# EAGLE design RFID_R1 (EAGLE 9.4.2)

## Sheet 1 of 2

## Sheet 2 of 2
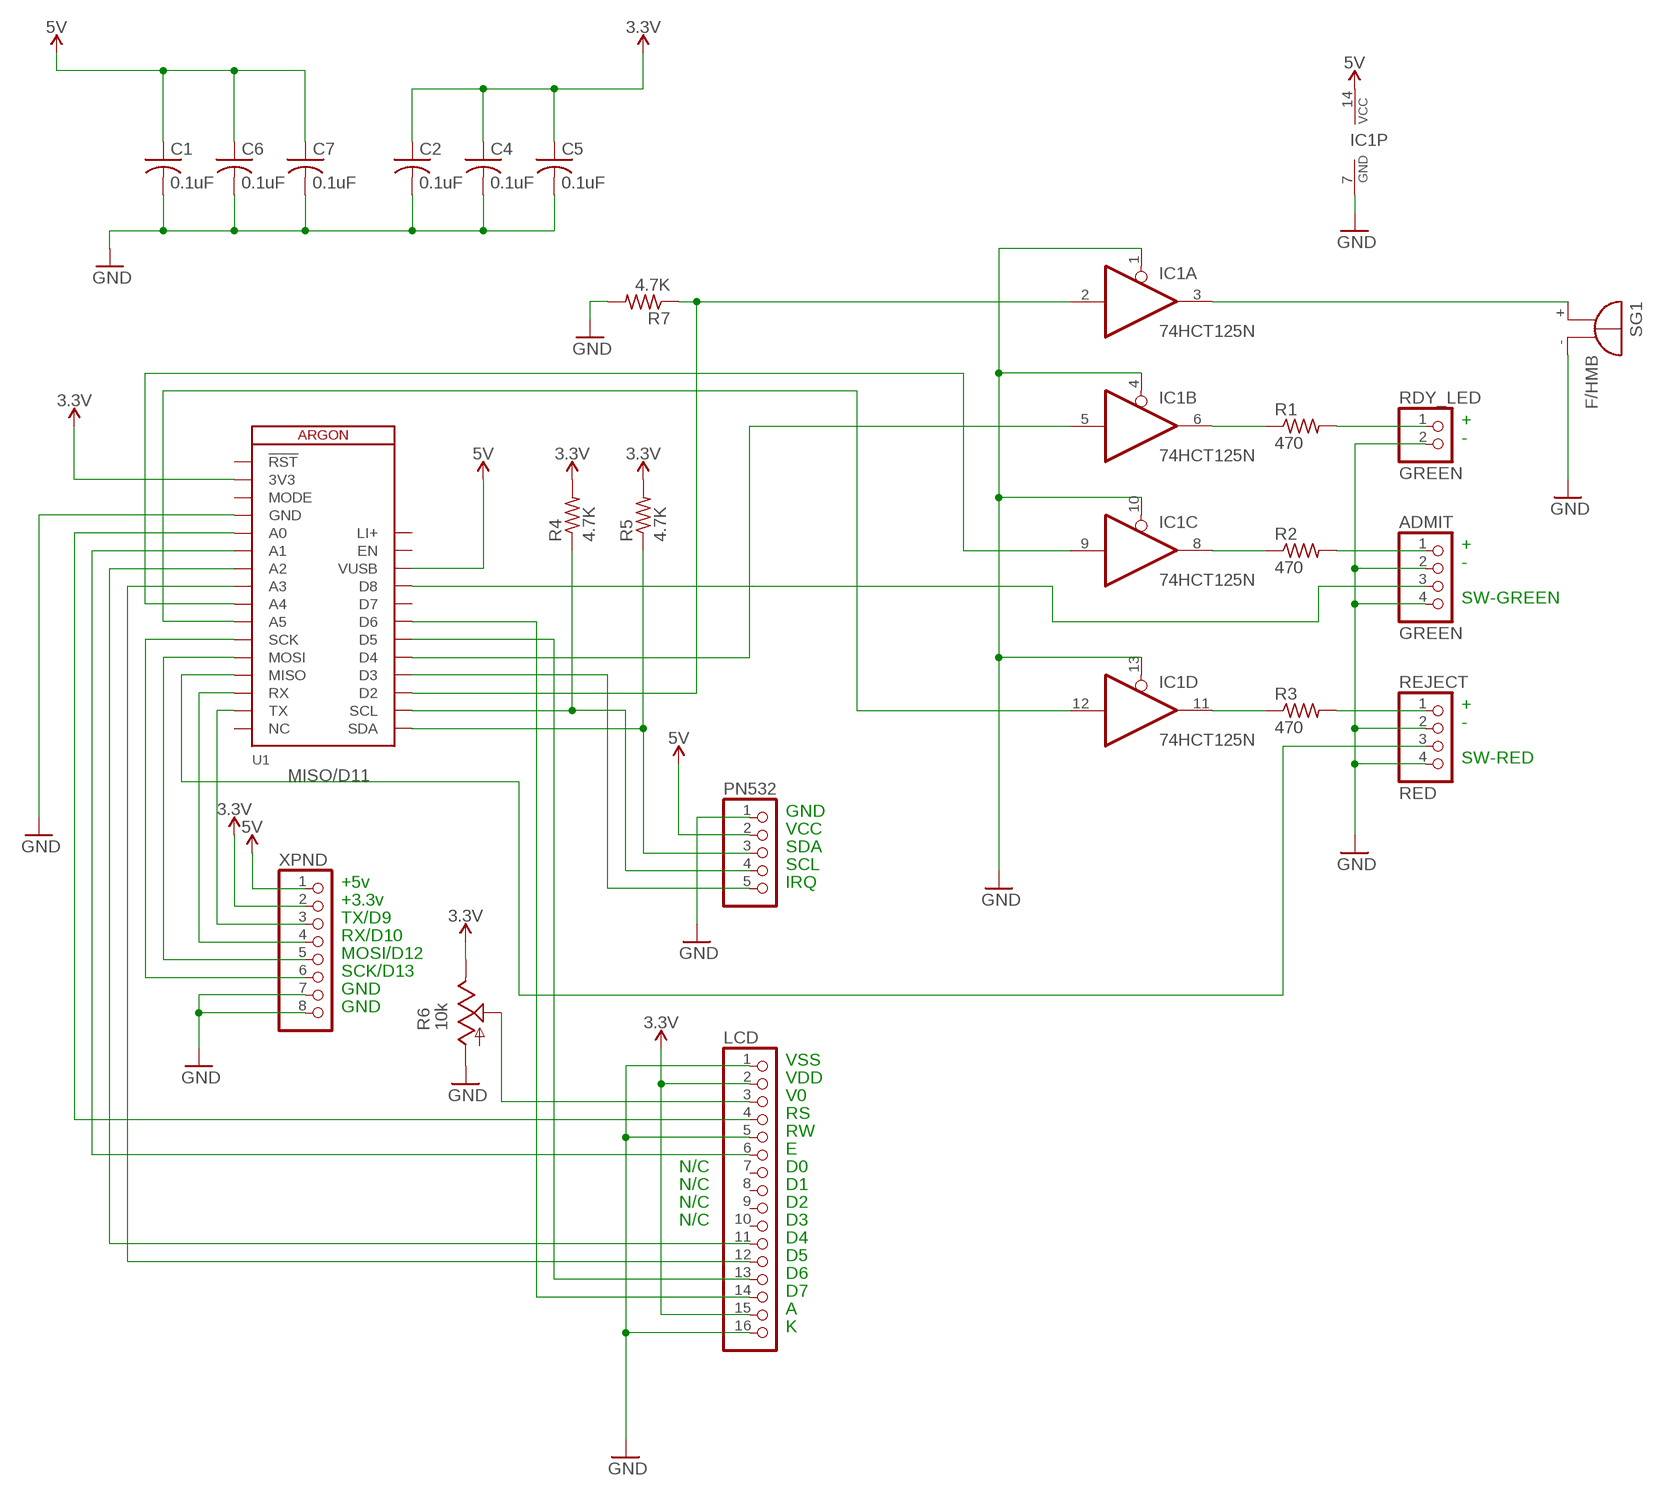
[diagram p0: schematic, sheet 2]

### Parts
ADMIT  GREEN  PINHD-1X4  [1X04]
C1  0.1uF  C-US025-024X044  [C025-024X044]
C2  0.1uF  C-US025-024X044  [C025-024X044]
C4  0.1uF  C-US025-024X044  [C025-024X044]
C5  0.1uF  C-US025-024X044  [C025-024X044]
C6  0.1uF  C-US025-024X044  [C025-024X044]
C7  0.1uF  C-US025-024X044  [C025-024X044]
IC1  74HCT125N  [DIL14]
LCD  PINHD-1X16  [1X16]
PN532  PINHD-1X5  [1X05]
R1  470  R-US_0204/7  [0204/7]
R2  470  R-US_0204/7  [0204/7]
R3  470  R-US_0204/7  [0204/7]
R4  4.7K  R-US_0204/7  [0204/7]
R5  4.7K  R-US_0204/7  [0204/7]
R6  10k  TRIM_US-CT6  [CT6]
R7  4.7K  R-US_0204/7  [0204/7]
RDY_LED  GREEN  PINHD-1X2  [1X02]
REJECT  RED  PINHD-1X4  [1X04]
SG1  F/HMB  [F/HMB]
U1  ARGON  [ARGON]
XPND  PINHD-1X8BIG  [1X08-BIG]

### Nets
3.3V: C2.1 C4.1 C5.1 LCD.2 LCD.15 R4.2 R5.2 R6.E U1.2(3V3) XPND.2
5V: C1.1 C6.1 C7.1 IC1.14(P:VCC) PN532.2 U1.26(VUSB) XPND.1
GND: ADMIT.2 ADMIT.4 C1.2 C2.2 C4.2 C5.2 C6.2 C7.2 IC1.1(A:OE) IC1.4(B:OE) IC1.7(P:GND) IC1.10(C:OE) IC1.13(D:OE) LCD.1 LCD.5 LCD.16 PN532.1 R6.A R7.2 RDY_LED.2 REJECT.2 REJECT.4 SG1.- U1.4(GND) XPND.7 XPND.8
MISO/D11: REJECT.3 U1.13(MISO)
N$1: IC1.3(A:O) SG1.+
N$2: IC1.6(B:O) R1.1
N$3: IC1.8(C:O) R2.1
N$4: IC1.11(D:O) R3.1
N$5: R1.2 RDY_LED.1
N$6: ADMIT.1 R2.2
N$7: R3.2 REJECT.1
N$8: LCD.4 U1.5(A0)
N$9: LCD.6 U1.6(A1)
N$10: LCD.11 U1.7(A2)
N$11: LCD.12 U1.8(A3)
N$12: LCD.13 U1.22(D5)
N$13: LCD.14 U1.23(D6)
N$14: PN532.4 R4.1 U1.18(SCL)
N$15: IC1.9(C:I) U1.9(A4)
N$16: PN532.3 R5.1 U1.17(SDA)
N$17: LCD.3 R6.S
N$18: PN532.5 U1.20(D3)
N$19: ADMIT.3 U1.25(D8)
N$20: IC1.5(B:I) U1.21(D4)
N$21: IC1.12(D:I) U1.10(A5)
N$22: IC1.2(A:I) R7.1 U1.19(D2)
N$24: U1.12(MOSI) XPND.5
N$25: U1.11(SCK) XPND.6
N$26: U1.14(RX) XPND.4
N$27: U1.15(TX) XPND.3
Unconnected: LCD.7 LCD.8 LCD.9 LCD.10 U1.1(!RST) U1.3(MODE) U1.16(NC) U1.24(D7) U1.27(EN)

### Notes on the sheet
- +
- -
- +
- -
- SW-GREEN
- +
- -
- SW-RED
- GND
- VCC
- SDA
- SCL
- +5v | IRQ
- +3.3v
- TX/D9
- RX/D10
- MOSI/D12
- SCK/D13
- GND
- GND
- VSS
- VDD
- V0
- RS
- RW
- E
- N/C | D0
- N/C | D1
- N/C | D2
- N/C | D3
- D4
- D5
- D6
- D7
- A
- K

## Power pins joined to a net without a drawn wire
LI+: U1.28(LI+)

## Library data of the parts
ADMIT REJECT = pinhead:PINHD-1X4: PIN HEADER
C1 C2 C4-C7 = adafruit:C-US: CAPACITOR, American symbol
IC1 = 74xx-eu:74*125: Quad bus BUFFER, 3-state
LCD = pinhead:PINHD-1X16: PIN HEADER
PN532 = pinhead:PINHD-1X5: PIN HEADER
R1-R5 R7 = adafruit:R-US_: RESISTOR, American symbol
R6 = pot:TRIM_US-: POTENTIOMETER
RDY_LED = pinhead:PINHD-1X2: PIN HEADER
SG1 = buzzer:F/HMB: BUZZER Source: Buerklin; OC_FARNELL: unknown; OC_NEWARK: unknown
U1 = Particle-Devices:ARGON: ARGON The Particle Argon is a powerful Wi-Fi development kit that you can use as a standalone Wi-Fi device or Wi-Fi enabled gateway, repeater, or endpoint for Particle Mesh networks. More information: https://docs.particle.io/argon/ Footprint and formfactor based on Adafruit Feather. <https://www.adafruit.com/feather>
XPND = adafruit:PINHD-1X8: PIN HEADER

## Board
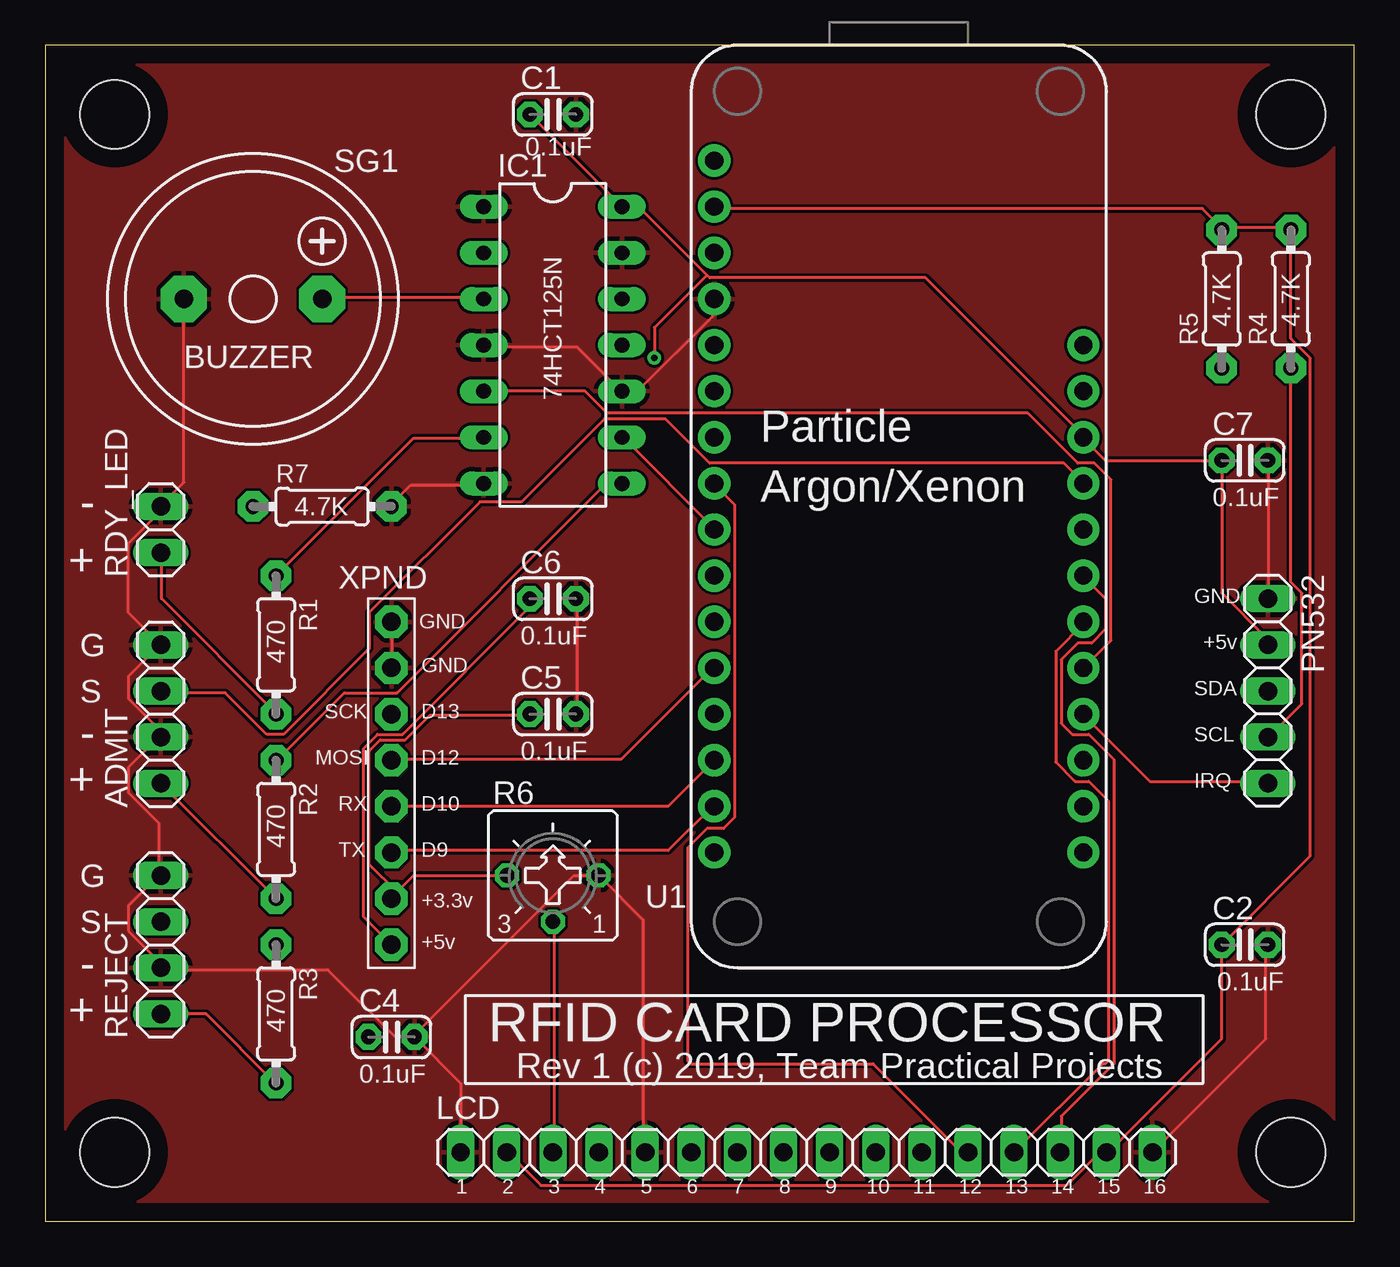
[diagram p1: board, top side]
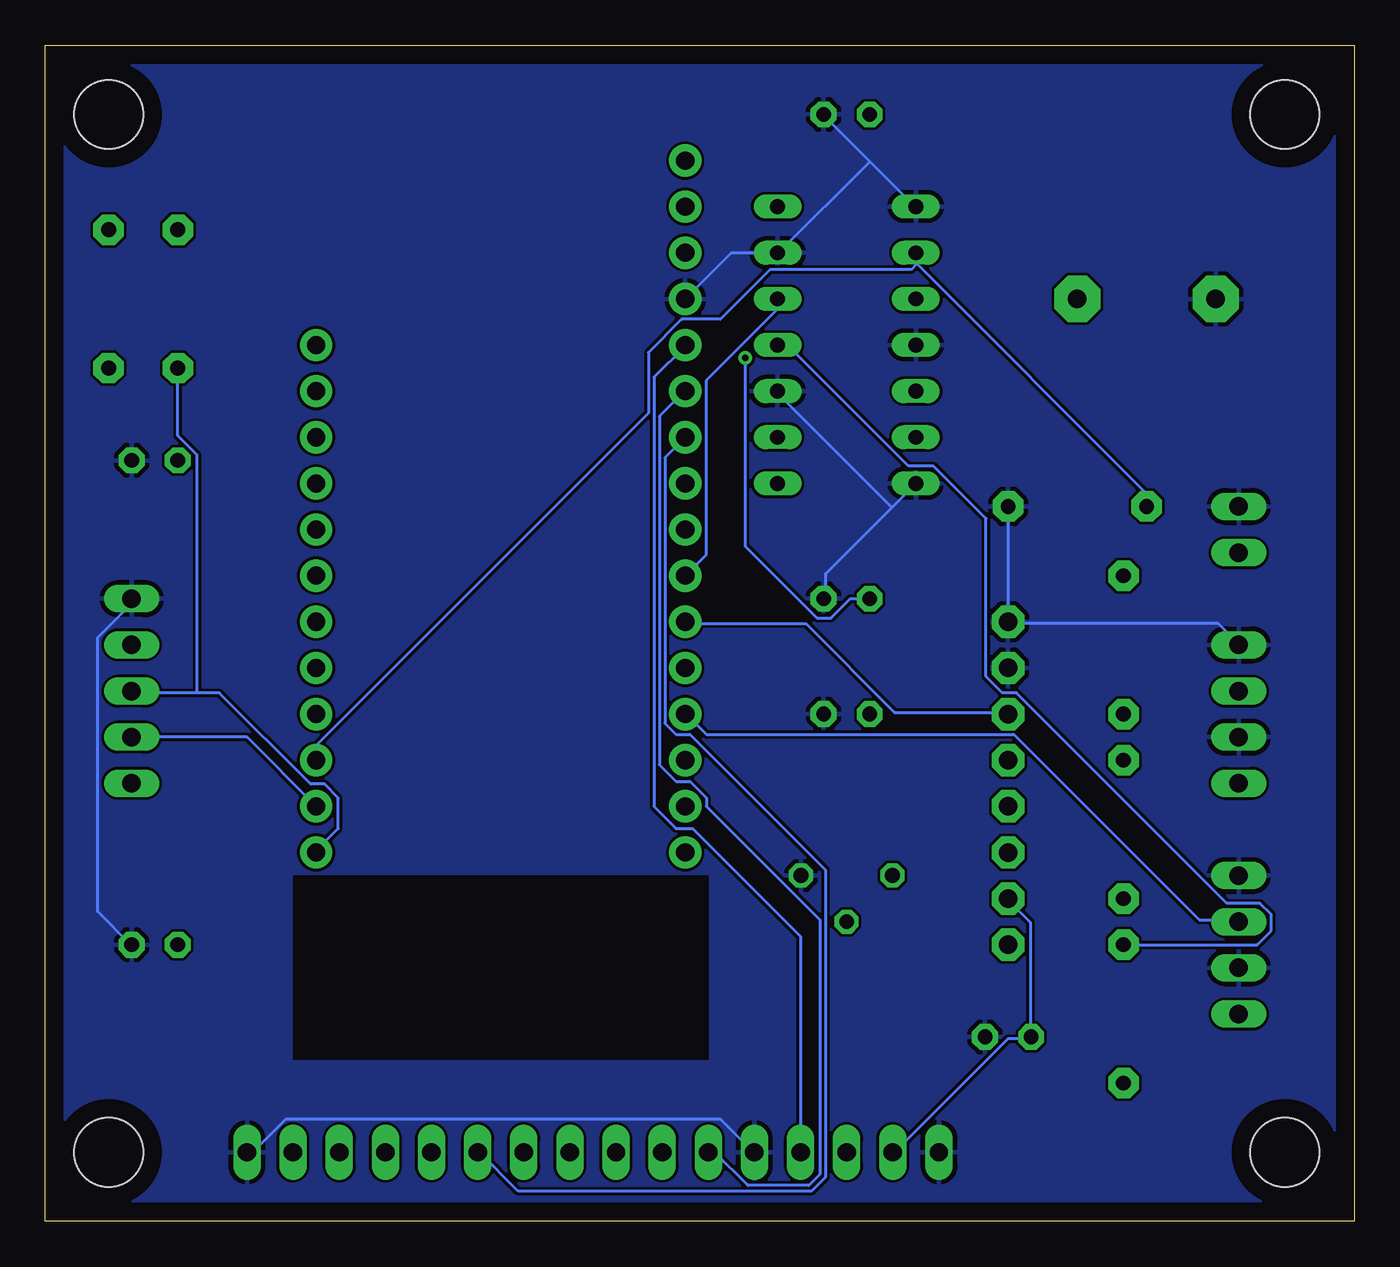
[diagram p2: board, bottom side, seen from below]

Size 72.06 x 64.76 mm. Coordinates in mm from the lower left corner, seen from the top.
Outline: 0,0 72.06,0 72.06,64.76 0,64.76 0,0
Copper layers (1*16): Top 0.035mm / dielectric 1.5mm / Bottom 0.035mm
Design rules "default": minimum track width 6mil, minimum drill 0.35mm, track to track 6mil, track to pad 6mil, pad to pad 6mil, via to via 6mil, smd to smd 6mil, copper to edge 40mil, drill to drill 6mil, minimum pad ring 10mil, minimum via ring 8mil, stop-mask expansion 4mil, vias tented up to drill 0mil, thermal gap 10mil
Holes 3.8 mm at 68.58,60.96 68.58,3.81 3.81,60.96 3.81,3.81

### Footprints (pad centres in the part's own frame; a part is rotated, then mirrored left to right if it is on the bottom)
1X04 = drill 1.016 long: 1 -3.81,0; 2 -1.27,0; 3 1.27,0; 4 3.81,0
C025-024X044 = drill 0.813 pad 1.422 octagon: 1 -1.27,0; 2 1.27,0
DIL14 = drill 0.813 long: 1 -7.62,-3.81; 2 -5.08,-3.81; 3 -2.54,-3.81; 4 0,-3.81; 5 2.54,-3.81; 6 5.08,-3.81; 7 7.62,-3.81; 8 7.62,3.81; 9 5.08,3.81; 10 2.54,3.81; 11 0,3.81; 12 -2.54,3.81; 13 -5.08,3.81; 14 -7.62,3.81
1X16 = drill 1.016 long: 1 -19.05,0; 2 -16.51,0; 3 -13.97,0; 4 -11.43,0; 5 -8.89,0; 6 -6.35,0; 7 -3.81,0; 8 -1.27,0; 9 1.27,0; 10 3.81,0; 11 6.35,0; 12 8.89,0; 13 11.43,0; 14 13.97,0; 15 16.51,0; 16 19.05,0
1X05 = drill 1.016 long: 1 -5.08,0; 2 -2.54,0; 3 0,0; 4 2.54,0; 5 5.08,0
0204/7 = drill 0.813 pad 1.676 octagon: 1 -3.81,0; 2 3.81,0
CT6 = drill 0.813 octagon: A 2.515,0; E -2.515,0; S 0,-2.54
1X02 = drill 1.016 long: 1 -1.27,0; 2 1.27,0
F/HMB = drill 1.016 pad 2.54 octagon: + 3.81,0; - -3.81,0
ARGON = drill 1 pad 1.778: 1 1.27,44.45; 2 1.27,41.91; 3 1.27,39.37; 4 1.27,36.83; 5 1.27,34.29; 6 1.27,31.75; 7 1.27,29.21; 8 1.27,26.67; 9 1.27,24.13; 10 1.27,21.59; 11 1.27,19.05; 12 1.27,16.51; 13 1.27,13.97; 14 1.27,11.43; 15 1.27,8.89; 16 1.27,6.35; 17 21.59,6.35; 18 21.59,8.89; 19 21.59,11.43; 20 21.59,13.97; 21 21.59,16.51; 22 21.59,19.05; 23 21.59,21.59; 24 21.59,24.13; 25 21.59,26.67; 26 21.59,29.21; 27 21.59,31.75; 28 21.59,34.29
1X08-BIG = drill 1.016 pad 1.778 octagon: 1 -8.89,0; 2 -6.35,0; 3 -3.81,0; 4 -1.27,0; 5 1.27,0; 6 3.81,0; 7 6.35,0; 8 8.89,0

### Placement (x,y rotation side)
ADMIT  6.35,27.94 90 top
C1  27.94,60.96 0 top
C2  66.04,15.24 0 top
C4  19.05,10.16 0 top
C5  27.94,27.94 0 top
C6  27.94,34.29 0 top
C7  66.04,41.91 0 top
IC1  27.94,48.26 270 top
LCD  41.91,3.81 0 top
PN532  67.31,29.21 270 top
R1  12.7,31.75 270 top
R2  12.7,21.59 270 top
R3  12.7,11.43 270 top
R4  68.58,50.8 90 top
R5  64.77,50.8 90 top
R6  27.94,19.05 0 top
R7  15.24,39.37 0 top
RDY_LED  6.35,38.1 90 top
REJECT  6.35,15.24 90 top
SG1  11.43,50.8 0 top
U1  35.56,13.97 0 top
XPND  19.05,24.13 90 top

### Tracks (layer width: path | path; a pad name or v marks a point on that pad's centre or on a via)
3.3V
  Top 0.152: 64.77,54.71 68.58,54.71 R4.2 68.58,48.62 69.65,47.55 69.65,20.12 C2.1 64.77,10.06 58.52,3.81 LCD.15 58.06,3.81 56.24,1.98 27.28,1.98 25.45,3.81 LCD.2 | 64.77,54.71 63.7,55.78 36.88,55.78 U1.2 | 64.77,54.71 R5.2 | R6.E 20.27,19.05 19.36,18.14 | 19.36,18.14 19.05,17.83 XPND.2 19.36,18.14 | 19.36,18.14 17.83,19.66 17.83,25.91 18.44,26.52 19.81,26.52 21.18,27.89 26.67,27.89 C5.1
  Bottom 0.152: XPND.2 19.05,17.68 17.83,16.46 17.83,10.21 C4.1 17.83,10.06 19.05,10.06 25.3,3.81 LCD.2
5V  (via drill 0.35)
  Top 0.152: C6.1 26.67,33.83 19.66,26.82 18.29,26.82 17.53,26.06 17.53,16.76 XPND.1 | C1.1 IC1.14 31.85,55.78 32.77,55.78 36.42,52.12 | PN532.2 67.21,31.85 67.21,32.16 64.77,34.59 C7.1 58.37,41.91 57.15,43.13 U1.26 57.15,43.28 48.46,51.97 36.58,51.97 36.42,52.12 | v33.53,47.55 33.53,49.23 36.42,52.12
  Bottom 0.152: C6.1 27.74,34.29 28.8,33.22 29.57,33.22 33.53,37.19 v33.53,47.55
GND
  Top 0.152: C5.2 29.26,28.04 29.26,34.29 C6.2 | XPND.8 XPND.7 | IC1.7 24.08,40.54 20.12,40.54 19.05,39.47 R7.2 | U1.4 36.73,50.75 36.73,49.84 32.61,45.72 IC1.10 31.7,45.72 29.26,48.16 24.23,48.16 IC1.4 | C7.2 67.36,41.91 67.36,34.29 PN532.1 | LCD.16 67.21,10.06 67.21,15.24 C2.2 | 20.27,10.21 29.11,19.05 R6.A 30.48,19.05 32.92,16.61 32.92,3.81 LCD.5 | LCD.1 22.86,7.62 C4.2 20.27,10.21 | 6.25,19.05 4.57,17.37 4.57,16 6.25,14.33 6.25,14.02 REJECT.2 6.4,13.87 15.54,13.87 19.2,10.21 20.27,10.21 | 6.25,26.67 6.25,27.13 4.57,28.8 4.57,30.02 6.25,31.7 ADMIT.4 4.57,33.53 4.57,37.34 6.25,39.01 6.25,39.32 RDY_LED.2 6.4,39.47 7.62,40.69 SG1.- | 6.25,19.05 6.25,21.95 4.57,23.62 4.57,24.99 6.25,26.67 | 6.25,19.05 REJECT.4 | 6.25,26.67 ADMIT.2
  Bottom 0.152: R7.2 XPND.8 19.05,32.92 7.47,32.92 6.4,31.85 ADMIT.4 | IC1.7 25.45,39.32 | 25.45,39.32 29.11,35.66 29.11,34.29 C6.2 | 26.67,58.37 29.26,60.96 C1.2 | 26.67,58.37 24.23,55.93 IC1.1 | U1.4 34.29,53.34 IC1.13 31.7,53.34 26.67,58.37 | 25.45,39.32 31.85,45.72 IC1.10 | PN532.1 67.36,34.29 67.36,33.98 69.19,32.16 69.19,17.07 67.36,15.24 C2.2 | LCD.16 60.66,3.81 58.83,5.64 34.9,5.64 33.07,3.81 LCD.5
  pour Top: 0,0 0,64.77 72.39,64.77 72.39,0
  pour Bottom: 0,0 0,64.77 72.39,64.77 72.39,0
MISO/D11
  Bottom 0.152: REJECT.3 6.4,16.61 8.53,16.61 18.75,26.82 35.66,26.82 36.73,27.89 U1.13
N$1
  Top 0.152: IC1.3 24.08,50.9 15.24,50.9 SG1.+
N$2
  Top 0.152: R1.1 20.27,43.13 24.08,43.13 IC1.6
N$3
  Top 0.152: IC1.8 31.7,40.54 30.79,40.54 19.36,29.11 16.46,29.11 12.8,25.45 R2.1
N$4
  Bottom 0.152: R3.1 5.33,15.24 4.57,16 4.57,16.92 5.18,17.53 7.01,17.53 18.59,29.11 19.36,29.11 20.27,30.02 20.27,38.71 23.16,41.6 24.54,41.6 31.09,48.16 31.7,48.16 IC1.11
N$5
  Top 0.152: RDY_LED.1 6.4,36.73 6.4,34.29 12.65,28.04 R1.2
N$6
  Top 0.152: R2.2 ADMIT.1
N$7
  Top 0.152: REJECT.1 8.84,11.43 12.65,7.62 R3.2
N$8
  Bottom 0.152: LCD.4 30.48,15.7 36.42,21.64 37.34,21.64 38.56,22.86 38.56,46.48 36.88,48.16 U1.5
N$9
  Bottom 0.152: LCD.6 35.2,3.81 33.38,1.98 30.02,1.98 29.41,2.59 29.41,16.61 35.66,22.86 35.66,23.32 36.58,24.23 37.34,24.23 38.25,25.15 38.25,44.35 36.88,45.72 U1.6
N$10
  Bottom 0.152: U1.7 37.95,42.06 37.95,27.43 37.34,26.82 36.58,26.82 29.11,19.36 29.11,2.44 29.87,1.68 46.02,1.68 48.16,3.81 LCD.11
N$11
  Top 0.152: LCD.12 50.44,3.81 45.57,8.69 35.51,8.69 35.36,8.84 35.36,20.57 36.42,21.64 37.34,21.64 37.95,22.25 37.95,39.47 36.88,40.54 U1.8
N$12
  Top 0.152: LCD.13 58.22,8.69 58.37,8.69 58.52,8.84 58.52,23.16 57.45,24.23 56.69,24.23 55.63,25.3 55.63,31.39 57.15,32.92 U1.22
N$13
  Top 0.152: LCD.14 55.93,3.81 55.93,5.79 58.83,8.69 58.83,25.45 57.45,26.82 56.54,26.82 55.93,27.43 55.93,30.94 56.84,31.85 57.61,31.85 58.37,32.61 58.37,34.29 57.15,35.51 U1.23
N$14
  Top 0.152: R4.1 68.58,35.2 69.19,34.59 69.19,28.5 67.36,26.67 PN532.4
  Bottom 0.152: PN532.4 60.96,26.67 U1.18
N$15
  Top 0.152: IC1.9 31.85,43.13 36.88,38.1 U1.9
N$16
  Bottom 0.152: 63.7,29.11 62.48,29.11 57.45,24.08 56.69,24.08 55.93,23.32 55.93,21.64 57.15,20.42 U1.17 | 63.7,29.11 67.21,29.11 PN532.3 | R5.1 64.77,43.28 63.7,42.22 63.7,29.11
N$17
  Top 0.152: R6.S 28.04,16.46 28.04,3.81 LCD.3
N$18
  Top 0.152: PN532.5 67.21,24.23 60.81,24.23 57.15,27.89 U1.20
N$19
  Top 0.152: ADMIT.3 6.4,29.11 9.91,29.11 12.19,26.82 13.11,26.82 17.83,31.55 17.83,33.53 23.93,39.62 26.21,39.62 30.79,44.2 34.14,44.2 36.58,41.76 56.08,41.76 57.15,40.69 U1.25
N$20
  Top 0.152: IC1.5 29.72,45.72 30.94,44.5 54.1,44.5 56.84,41.76 57.76,41.76 58.67,40.84 58.67,32 U1.21
N$21
  Bottom 0.152: U1.10 35.66,36.73 35.66,46.33 31.85,50.14 31.85,50.75 IC1.12
N$22
  Bottom 0.152: 24.08,52.73 24.08,53.34 IC1.2 24.08,52.73 | 24.08,52.73 11.43,40.08 R7.1 | U1.19 57.15,26.21 38.86,44.5 38.86,47.85 37.03,49.68 34.9,49.68 32.16,52.43 24.38,52.43 24.08,52.73
N$24
  Top 0.152: XPND.5 19.05,25.45 31.7,25.45 36.73,30.48 U1.12
N$25
  Bottom 0.152: XPND.6 19.05,28.04 25.3,28.04 30.18,32.92 36.73,32.92 U1.11
N$26
  Top 0.152: XPND.4 34.29,22.86 U1.14
N$27
  Top 0.152: XPND.3 19.05,20.42 34.29,20.42 36.73,22.86 U1.15

### Text on the board
tPlace: 0.1uF | 4.7K | 4.7K | BUZZER | 74HCT125N | Particle | Argon/Xenon | - | 4.7K | 0.1uF | + | GND | GND | 0.1uF | G | 470 | +5v | GND | S | SDA | SCK | D13 | - | SCL | MOSI | D12 | 0.1uF | IRQ | + | RX | D10 | 470 | TX | D9 | G | +3.3v | S | +5v | - | 0.1uF | + | 470 | RFID CARD PROCESSOR | 0.1uF | Rev 1 (c) 2019, Team Practical Projects | 1 | 2 | 3 | 4 | 5 | 6 | 7 | 8 | 9 | 10 | 11 | 12 | 13 | 14 | 15 | 16